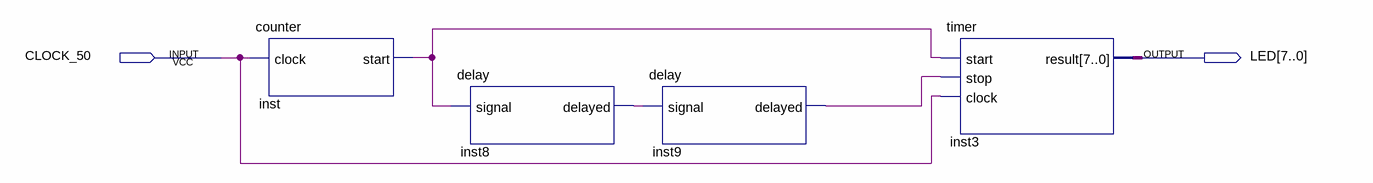
[diagram p0: schematic sheet]
// Quartus schematic LATENCY.bdf as structural Verilog: 4 symbols, 2 pins
module LATENCY (
  input  CLOCK_50,
  output [7:0] LED
);

  wire inst8_delayed, inst9_delayed, inst_start;

  counter inst (.clock(CLOCK_50), .start(inst_start));
  delay inst8 (.signal(inst_start), .delayed(inst8_delayed));
  delay inst9 (.signal(inst8_delayed), .delayed(inst9_delayed));
  timer inst3 (.start(inst_start), .stop(inst9_delayed), .clock(CLOCK_50), .result(LED));
endmodule
